# Altium schematic sheet TopLevel.SchDoc
size A4; SheetNumber: 1; SheetTotal: 1
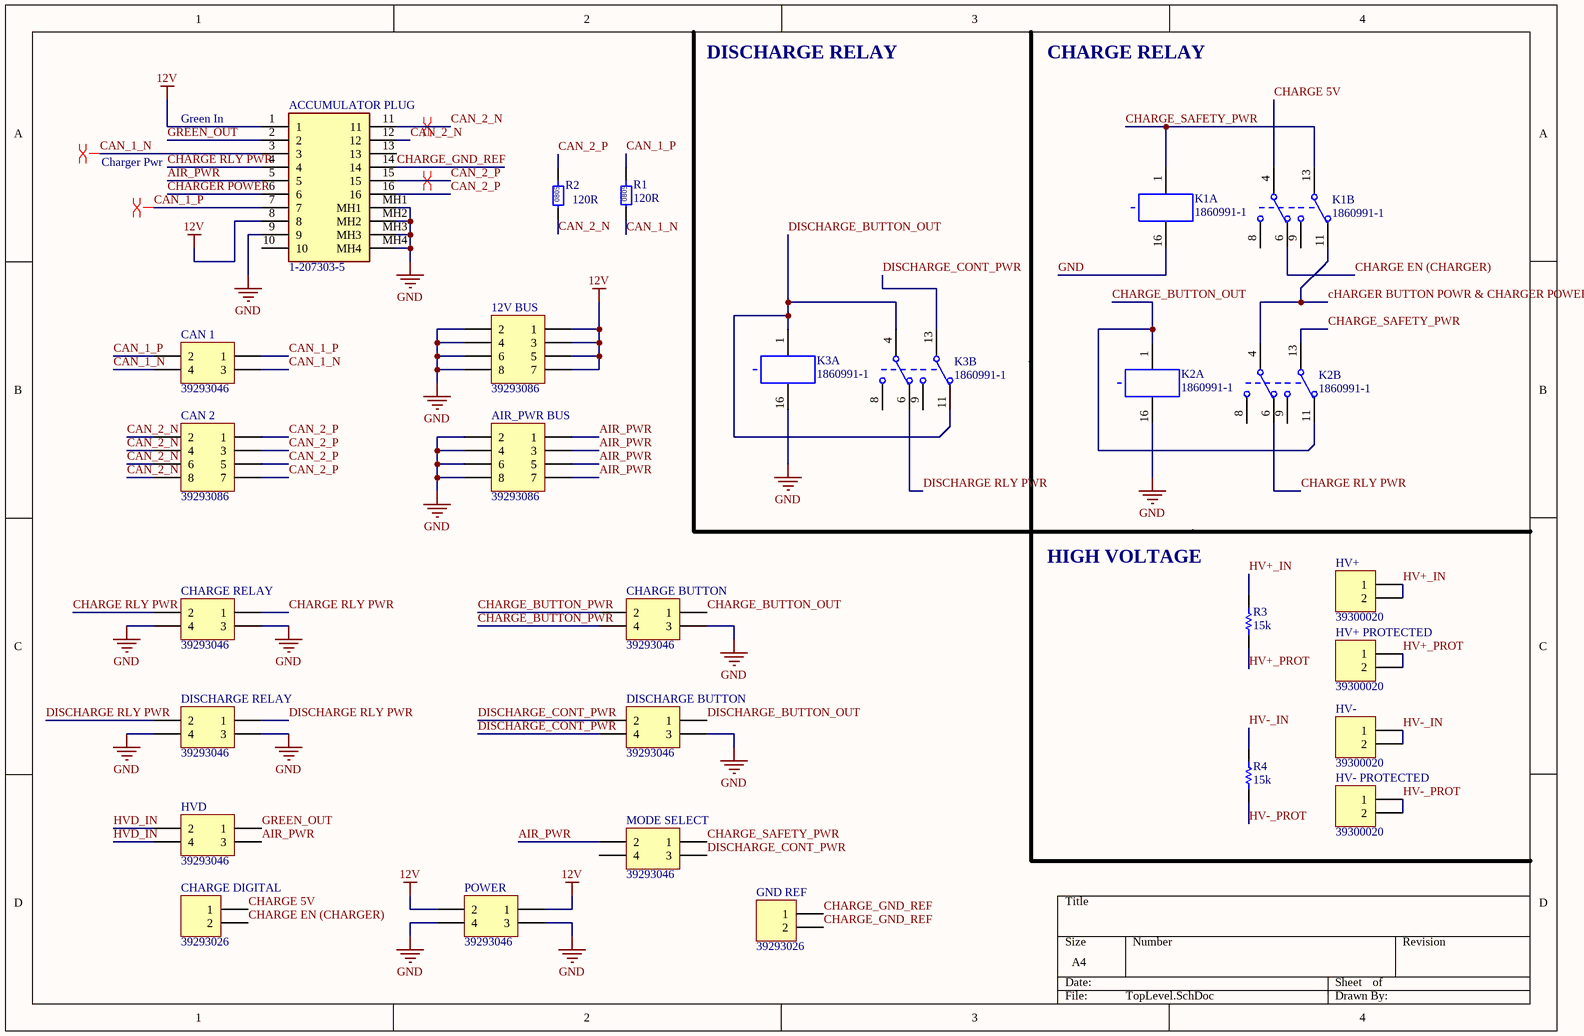
[diagram p0: TopLevel.SchDoc]

## Parts
12V_BUS  39293086  [39293086]
ACCUMULATOR_PLUG  1-207303-5  [12073035]
AIR_PWR_BUS  39293086  [39293086]
CAN_1  39293046  [39293046]
CAN_2  39293086  [39293086]
CHARGE_BUTTON  39293046  [39293046]
CHARGE_DIGITAL  39293026  [39293026]
CHARGE_RELAY  39293046  [39293046]
DISCHARGE_BUTTON  39293046  [39293046]
DISCHARGE_RELAY  39293046  [39293046]
GND_REF  39293026  [39293026]
HV+  39300020  [39300020]
HV+_PROTECTED  39300020  [39300020]
HV-  39300020  [39300020]
HV-_PROTECTED  39300020  [39300020]
HVD  39293046  [39293046]
K1  1860991-1  [1860991-1]  (parts A,B of 2)
K2  1860991-1  [1860991-1]  (parts A,B of 2)
K3  1860991-1  [1860991-1]  (parts A,B of 2)
MODE_SELECT  39293046  [39293046]
POWER  39293046  [39293046]
R1  120R  [0805]
R2  120R  [0805]
R3  15k  [TE_SMF7]
R4  15k  [TE_SMF7]

## Nets
12V: 12V_BUS.1 12V_BUS.3 12V_BUS.5 12V_BUS.7 ACCUMULATOR_PLUG.1 ACCUMULATOR_PLUG.8 POWER.1 POWER.2
GND: 12V_BUS.2 12V_BUS.4 12V_BUS.6 12V_BUS.8 ACCUMULATOR_PLUG.9 ACCUMULATOR_PLUG.MH1 ACCUMULATOR_PLUG.MH2 ACCUMULATOR_PLUG.MH3 ACCUMULATOR_PLUG.MH4 AIR_PWR_BUS.2 AIR_PWR_BUS.4 AIR_PWR_BUS.6 AIR_PWR_BUS.8 CHARGE_BUTTON.3 CHARGE_RELAY.3 CHARGE_RELAY.4 DISCHARGE_BUTTON.3 DISCHARGE_RELAY.3 DISCHARGE_RELAY.4 K1.16 K2.16 K3.16 POWER.3 POWER.4
AIR_PWR: ACCUMULATOR_PLUG.5 AIR_PWR_BUS.1 AIR_PWR_BUS.3 AIR_PWR_BUS.5 AIR_PWR_BUS.7 HVD.3 MODE_SELECT.2
CAN_1_N: ACCUMULATOR_PLUG.3 CAN_1.3 CAN_1.4 R1.1
CAN_1_P: ACCUMULATOR_PLUG.7 CAN_1.1 CAN_1.2 R1.2
CAN_2_N: ACCUMULATOR_PLUG.11 ACCUMULATOR_PLUG.12 CAN_2.2 CAN_2.4 CAN_2.6 CAN_2.8 R2.1
CAN_2_P: ACCUMULATOR_PLUG.15 ACCUMULATOR_PLUG.16 CAN_2.1 CAN_2.3 CAN_2.5 CAN_2.7 R2.2
CHARGE 5V: CHARGE_DIGITAL.1 K1.4
CHARGE EN (CHARGER): CHARGE_DIGITAL.2 K1.6
CHARGE RLY PWR: ACCUMULATOR_PLUG.4 CHARGE_RELAY.1 CHARGE_RELAY.2 K2.6
CHARGE_BUTTON_OUT: CHARGE_BUTTON.1 K2.1 K2.11
CHARGE_BUTTON_PWR: CHARGE_BUTTON.2 CHARGE_BUTTON.4
CHARGE_GND_REF: ACCUMULATOR_PLUG.14 GND_REF.1 GND_REF.2
CHARGE_SAFETY_PWR: K1.1 K1.13 K2.13 MODE_SELECT.1
cHARGER BUTTON POWR & CHARGER POWER: K1.11 K2.4
CHARGER POWER: ACCUMULATOR_PLUG.6
DISCHARGE RLY PWR: DISCHARGE_RELAY.1 DISCHARGE_RELAY.2 K3.6
DISCHARGE_BUTTON_OUT: DISCHARGE_BUTTON.1 K3.1 K3.4 K3.11
DISCHARGE_CONT_PWR: DISCHARGE_BUTTON.2 DISCHARGE_BUTTON.4 K3.13 MODE_SELECT.3
GREEN_OUT: ACCUMULATOR_PLUG.2 HVD.1
HV+_IN: HV+.1 HV+.2 R3.2
HV+_PROT: HV+_PROTECTED.1 HV+_PROTECTED.2 R3.1
HV-_IN: HV-.1 HV-.2 R4.2
HV-_PROT: HV-_PROTECTED.1 HV-_PROTECTED.2 R4.1
HVD_IN: HVD.2 HVD.4

Not connected (* = marked no-connect by the designer): ACCUMULATOR_PLUG 10 13; K1 8 9; K2 8 9; K3 8 9; MODE_SELECT 4

## Layout directives
differential pair: CAN_1_N, CAN_1_P, CAN_2_N, CAN_2_P

## Notes on the sheet
- DISCHARGE RELAY
- CHARGE RELAY
- Charger Pwr
- Green In
- HIGH VOLTAGE
- (in symbol RC0805FR07120RL) 0805

## Library data of the parts
12V_BUS AIR_PWR_BUS CAN_2 = 39293086: Pitch: 4.2mm; Row Spacing: 5.5mm; Angle: 0; Flange: No; Contact: Tin; Part Number: 39293086; Positions: 8; Digikey Part Number: WM3846-ND
ACCUMULATOR_PLUG = 1-207303-5: Connector; Manufacturer_Name: TE Connectivity; Datasheet Link: https://www.arrow.com/en/products/1-207303-5/te-connectivity; Height: 34.417mm; Manufacturer_Part_Number: 1-207303-5; Mouser Part Number: 571-1-207303-5; Mouser Price/Stock: https://www.mouser.co.uk/ProductDetail/TE-Connectivity/1-207303-5?qs=GQ3BsEl46pk51%252B5f3zYlzg%3D%3D; Arrow Part Number: 1-207303-5; Arrow Price/Stock: https://www.arrow.com/en/products/1-207303-5/te-connectivity
CAN_1 CHARGE_BUTTON CHARGE_RELAY DISCHARGE_BUTTON DISCHARGE_RELAY HVD MODE_SELECT POWER = 39293046: Pitch: 4.2mm; Row Spacing: 5.5mm; Angle: 0; Flange: No; Contact: Tin; Part Number: 39293046; Positions: 4; Digikey Part Number: WM3844-ND
CHARGE_DIGITAL GND_REF = 39293026: Pitch: 4.2mm; Row Spacing: 5.5mm; Angle: 0; Flange: No; Contact: Tin; Part Number: 39293026; Positions: 2; Digikey Part Number: WM3843-ND
HV+ HV+_PROTECTED HV- HV-_PROTECTED = 39300020: Pitch: 4.2mm; Row Spacing: 5.5mm; Angle: 90; Flange: No; Contact: Tin; Part Number: 39300020; Positions: 2; Digikey Part Number: WM21351-ND
K1-K3 = 1860991-1: RT78602 RELAY SOCKET PCB 5MM; Manufacturer: TE Connectivity; Part Number: 1860991-1; Digikey Part Number: 41-1860991-1-ND; Digikey Link: https://www.digikey.com.au/en/products/detail/te-connectivity-potter-brumfield-relays/1860991-1/11192373
R1 R2 = RC0805FR07120RL: Manufacturer: YAGEO; Tolerance: 0.01; Rated Power: 0.125W; Part Number: RC0805FR07120RL; Value: 120R; Material: FR-07; Digikey Part Number: 311-120CRCT-ND
R3 R4 = SMF715KJ: Manufacturer: TE; Tolerance: 0.05; Rated Power: 7W; Part Number: SMF715KJ; Value: 15k; Material: Metal Film